# EAGLE schematic arduino_pins (EAGLE 6.4)
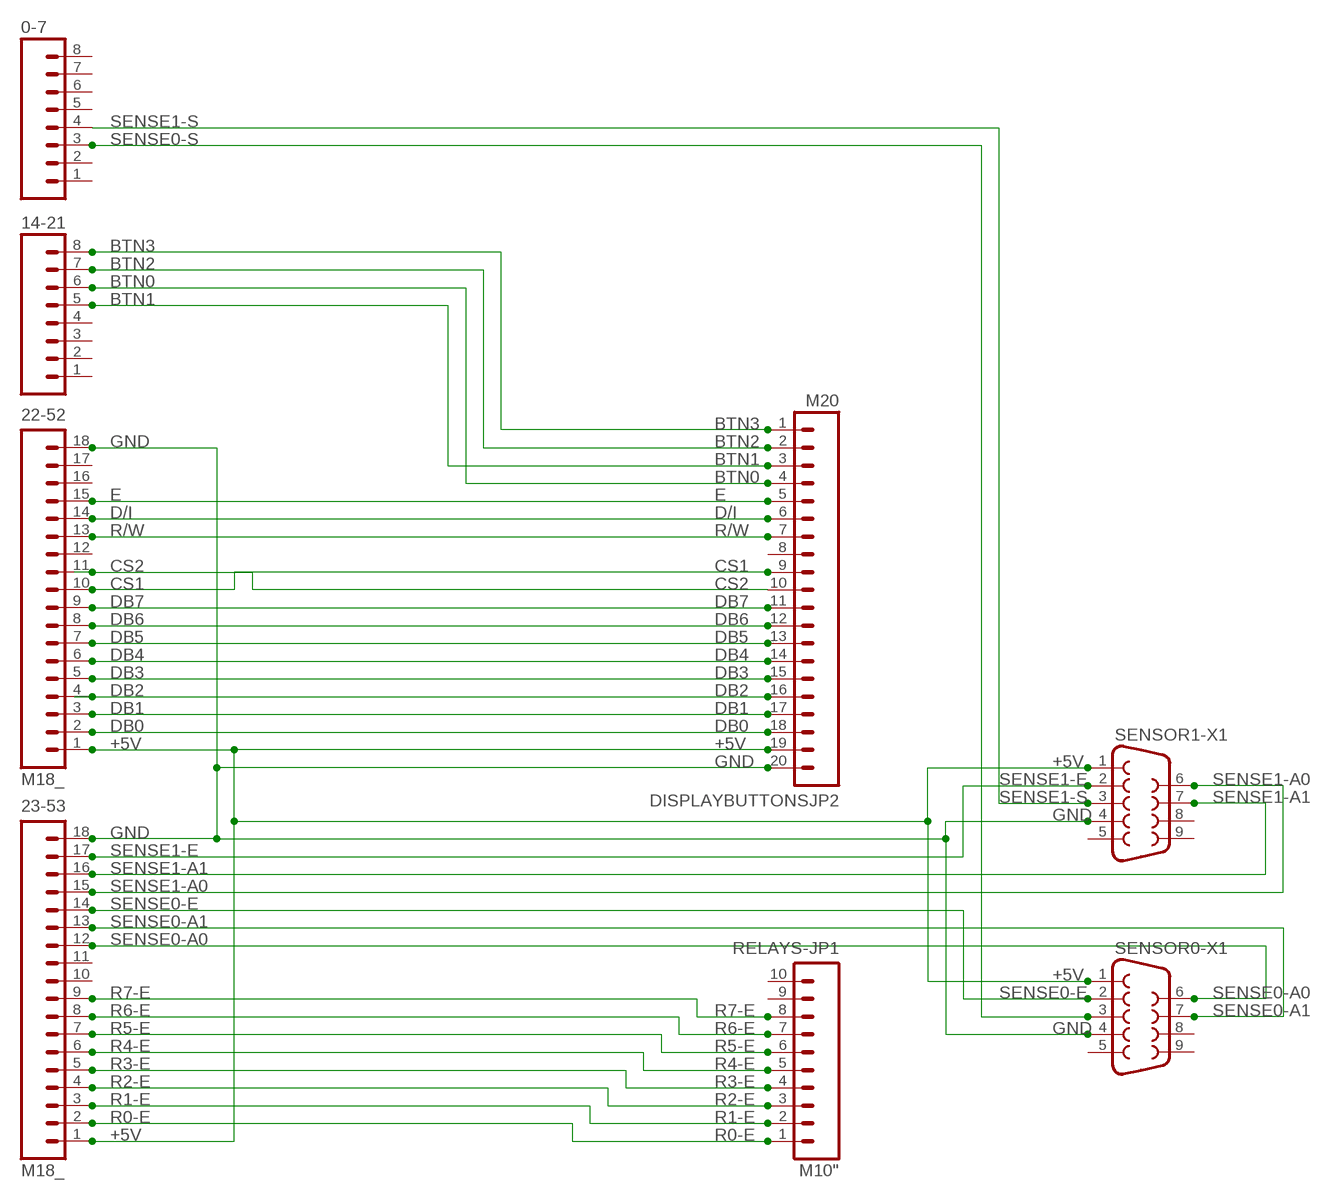
[diagram p0: schematic, sheet 1]

## Parts
0-7  M081X08  [1X08]
14-21  M081X08  [1X08]
22-52  M18_  [1X18]
23-53  M18_  [1X18]
DISPLAYBUTTONSJP2  M20  [1X20]
RELAYS-JP1  M10"  [1X10]
SENSOR0-X1  DB9MALE  [DB9_MALE]
SENSOR1-X1  DB9MALE  [DB9_MALE]

## Nets
+5V: 22-52.1 23-53.1 DISPLAYBUTTONSJP2.19 SENSOR0-X1.1 SENSOR1-X1.1
BTN0: 14-21.6 DISPLAYBUTTONSJP2.4
BTN1: 14-21.5 DISPLAYBUTTONSJP2.3
BTN2: 14-21.7 DISPLAYBUTTONSJP2.2
BTN3: 14-21.8 DISPLAYBUTTONSJP2.1
CS1: 22-52.10 DISPLAYBUTTONSJP2.9
CS2: 22-52.11 DISPLAYBUTTONSJP2.10
D/I: 22-52.14 DISPLAYBUTTONSJP2.6
DB0: 22-52.2 DISPLAYBUTTONSJP2.18
DB1: 22-52.3 DISPLAYBUTTONSJP2.17
DB2: 22-52.4 DISPLAYBUTTONSJP2.16
DB3: 22-52.5 DISPLAYBUTTONSJP2.15
DB4: 22-52.6 DISPLAYBUTTONSJP2.14
DB5: 22-52.7 DISPLAYBUTTONSJP2.13
DB6: 22-52.8 DISPLAYBUTTONSJP2.12
DB7: 22-52.9 DISPLAYBUTTONSJP2.11
E: 22-52.15 DISPLAYBUTTONSJP2.5
GND: 22-52.18 23-53.18 DISPLAYBUTTONSJP2.20 SENSOR0-X1.4 SENSOR1-X1.4
R0-E: 23-53.2 RELAYS-JP1.1
R1-E: 23-53.3 RELAYS-JP1.2
R2-E: 23-53.4 RELAYS-JP1.3
R3-E: 23-53.5 RELAYS-JP1.4
R4-E: 23-53.6 RELAYS-JP1.5
R5-E: 23-53.7 RELAYS-JP1.6
R6-E: 23-53.8 RELAYS-JP1.7
R7-E: 23-53.9 RELAYS-JP1.8
R/W: 22-52.13 DISPLAYBUTTONSJP2.7
SENSE0-A0: 23-53.12 SENSOR0-X1.6
SENSE0-A1: 23-53.13 SENSOR0-X1.7
SENSE0-E: 23-53.14 SENSOR0-X1.2
SENSE0-S: 0-7.3 SENSOR0-X1.3
SENSE1-A0: 23-53.15 SENSOR1-X1.6
SENSE1-A1: 23-53.16 SENSOR1-X1.7
SENSE1-E: 23-53.17 SENSOR1-X1.2
SENSE1-S: 0-7.4 SENSOR1-X1.3
Unconnected: 0-7.1 0-7.2 0-7.5 0-7.6 0-7.7 0-7.8 14-21.1 14-21.2 14-21.3 14-21.4 22-52.12 22-52.16 22-52.17 23-53.10 23-53.11 DISPLAYBUTTONSJP2.8 RELAYS-JP1.9 RELAYS-JP1.10 SENSOR0-X1.5 SENSOR0-X1.8 SENSOR0-X1.9 SENSOR1-X1.5 SENSOR1-X1.8 SENSOR1-X1.9

## Library data of the parts
0-7 14-21 = SparkFun-Connectors:M08: Header 8 Standard 8-pin 0.1" header. Use with straight break away headers (SKU : PRT-00116), right angle break away headers (PRT-00553), swiss pins (PRT-00743), machine pins (PRT-00117), and female headers (PRT-00115).
22-52 23-53 = SparkFun-Connectors:M18: 1x18 .1" header
DISPLAYBUTTONSJP2 = SparkFun-Connectors:M20: 1x20 .1" header This is just like the LOCK variant in that the holes are staggared by 5 mil, but except for the last two holes. They are not altered from the "standard" footprint layout. This is used for a special purpose on the layout of our Graphic LCD Backpack. Make sure you want to use this device before selecting it for you project!
RELAYS-JP1 = SparkFun-Connectors:M10: Header 10 Standard 10-pin 0.1" header. Use with straight break away headers (SKU : PRT-00116), right angle break away headers (PRT-00553), swiss pins (PRT-00743), machine pins (PRT-00117), and female headers (PRT-00115).
SENSOR0-X1 SENSOR1-X1 = SparkFun-Connectors:DB9: DB9 Connector Standard DB9 (D-Sub 9) serial connector. Can be used for CAN bus as well as RS485 and RS232. Footprint production proven. Spark Fun Electronics SKU : PRT-00429